# EasyEDA schematic PCB_design_2021-05-29.json
TITLE: Sheet_1; REV: 1.0; Date: 2021-05-29; Sheet: 1/1; Drawn By: niranjanShrestha; Company: Your Company
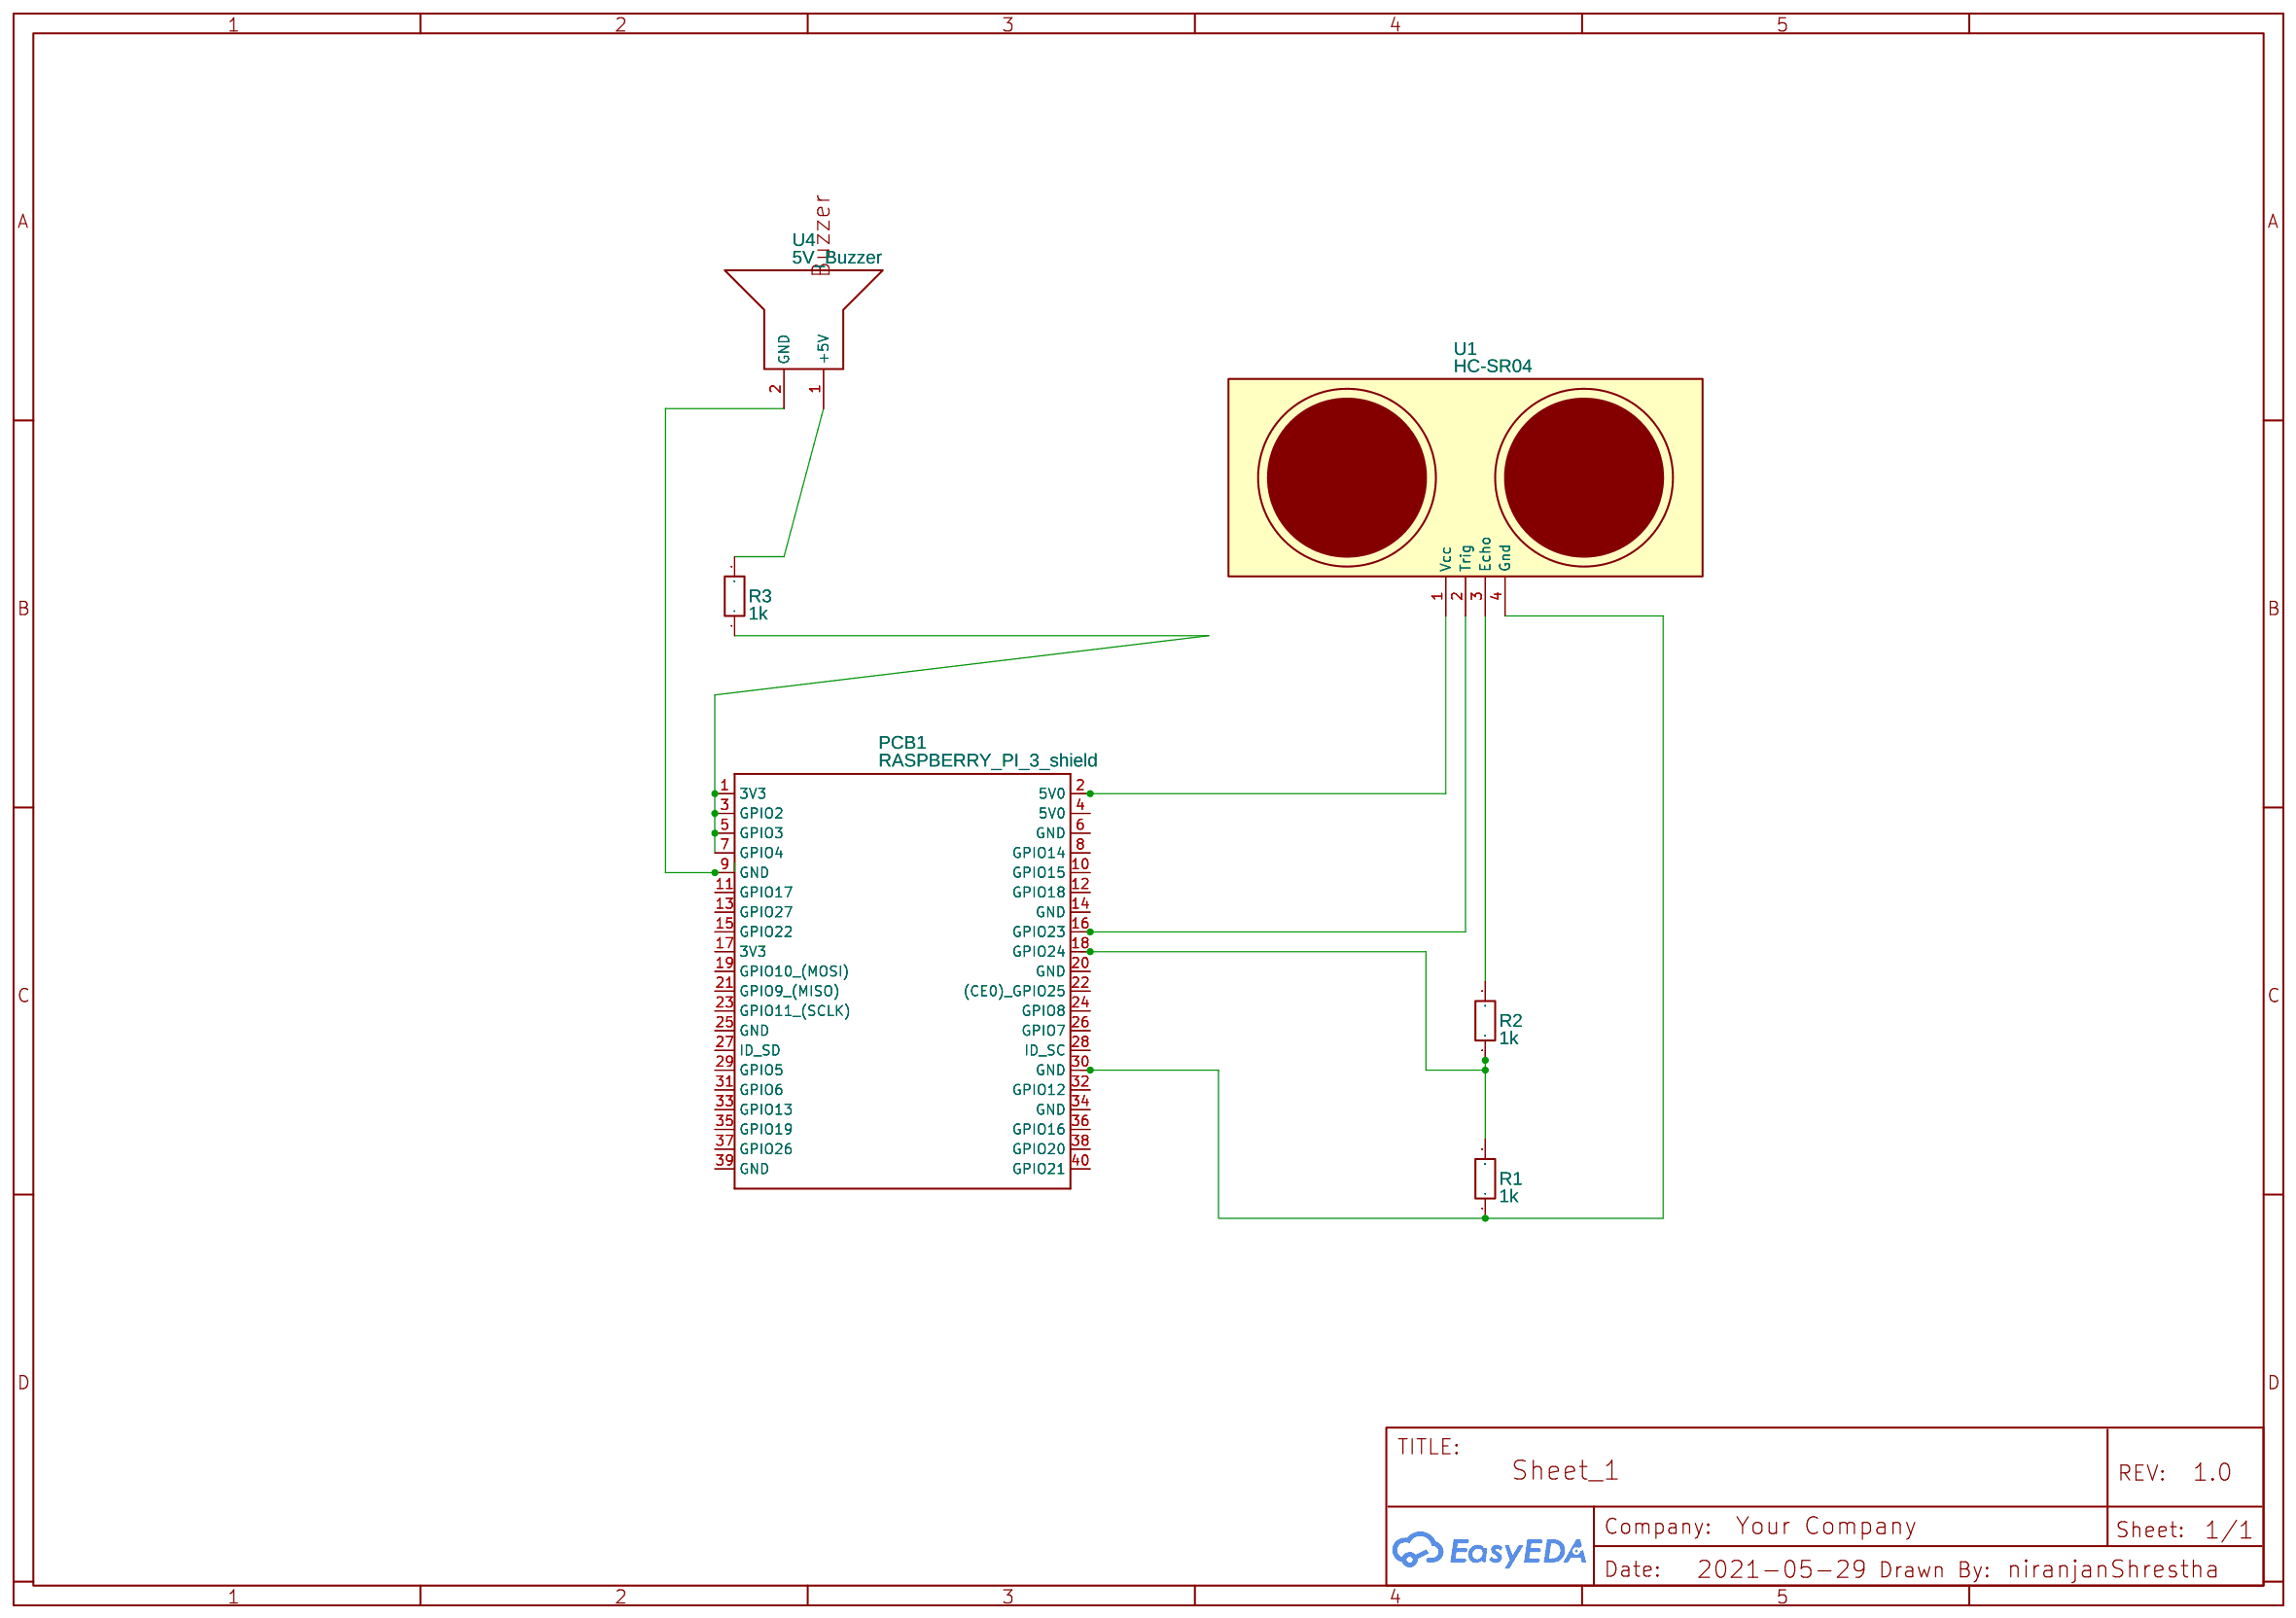
[diagram p0: schematic sheet]

## Parts
PCB1  RASPBERRY_PI_3_shield  [RASPBERRY PI MODEL 3 SHIELD]
R1  1k  [R0201]
R2  1k  [R0201]
R3  1k  [R0201]
U1  HC-SR04  [HC-SR04]
U4  5V_Buzzer  [5VBUZZER_2]

## Library data of the parts
PCB1 = RASPBERRY_PI_3_shield: Raspberry Pi B+; sourceId: a8qICUO6o; Contributor: merge
R1-R3 = R_0201_EU: Contributor: LCEDA_Lib
U1 = HC-SR04: Contributor: Anastasiya
U4 = 5V_Buzzer: Contributor: david.marzocca; Manufacturer Part: HN9650B

## Nets
Net-(PCB1-1): PCB1.1(3V3) PCB1.3(GPIO2) PCB1.5(GPIO3) PCB1.7(GPIO4) R3.1
Net-(PCB1-2): PCB1.2(5V0) U1.1(Vcc)
Net-(PCB1-9): PCB1.9(GND) U4.2(GND)
Net-(PCB1-16): PCB1.16(GPIO23) U1.2(Trig)
Net-(PCB1-18): PCB1.18(GPIO24) R1.2 R2.1
Net-(PCB1-30): PCB1.30(GND) R1.1 U1.4(Gnd)
Net-(R2-2): R2.2 U1.3(Echo)
Net-(R3-2): R3.2 U4.1(+5V)

Not connected (* = marked no-connect by the designer): PCB1 4(5V0) 6(GND) 8(GPIO14) 10(GPIO15) 11(GPIO17) 12(GPIO18) 13(GPIO27) 14(GND) 15(GPIO22) 17(3V3) 19(GPIO10 (MOSI)) 20(GND) 21(GPIO9 (MISO)) 22((CE0) GPIO25) 23(GPIO11 (SCLK)) 24(GPIO8) 25(GND) 26(GPIO7) 27(ID_SD) 28(ID_SC) 29(GPIO5) 31(GPIO6) 32(GPIO12) 33(GPIO13) 34(GND) 35(GPIO19) 36(GPIO16) 37(GPIO26) 38(GPIO20) 39(GND) 40(GPIO21)
